# Altium project IOT_Help_2.PrjPcb
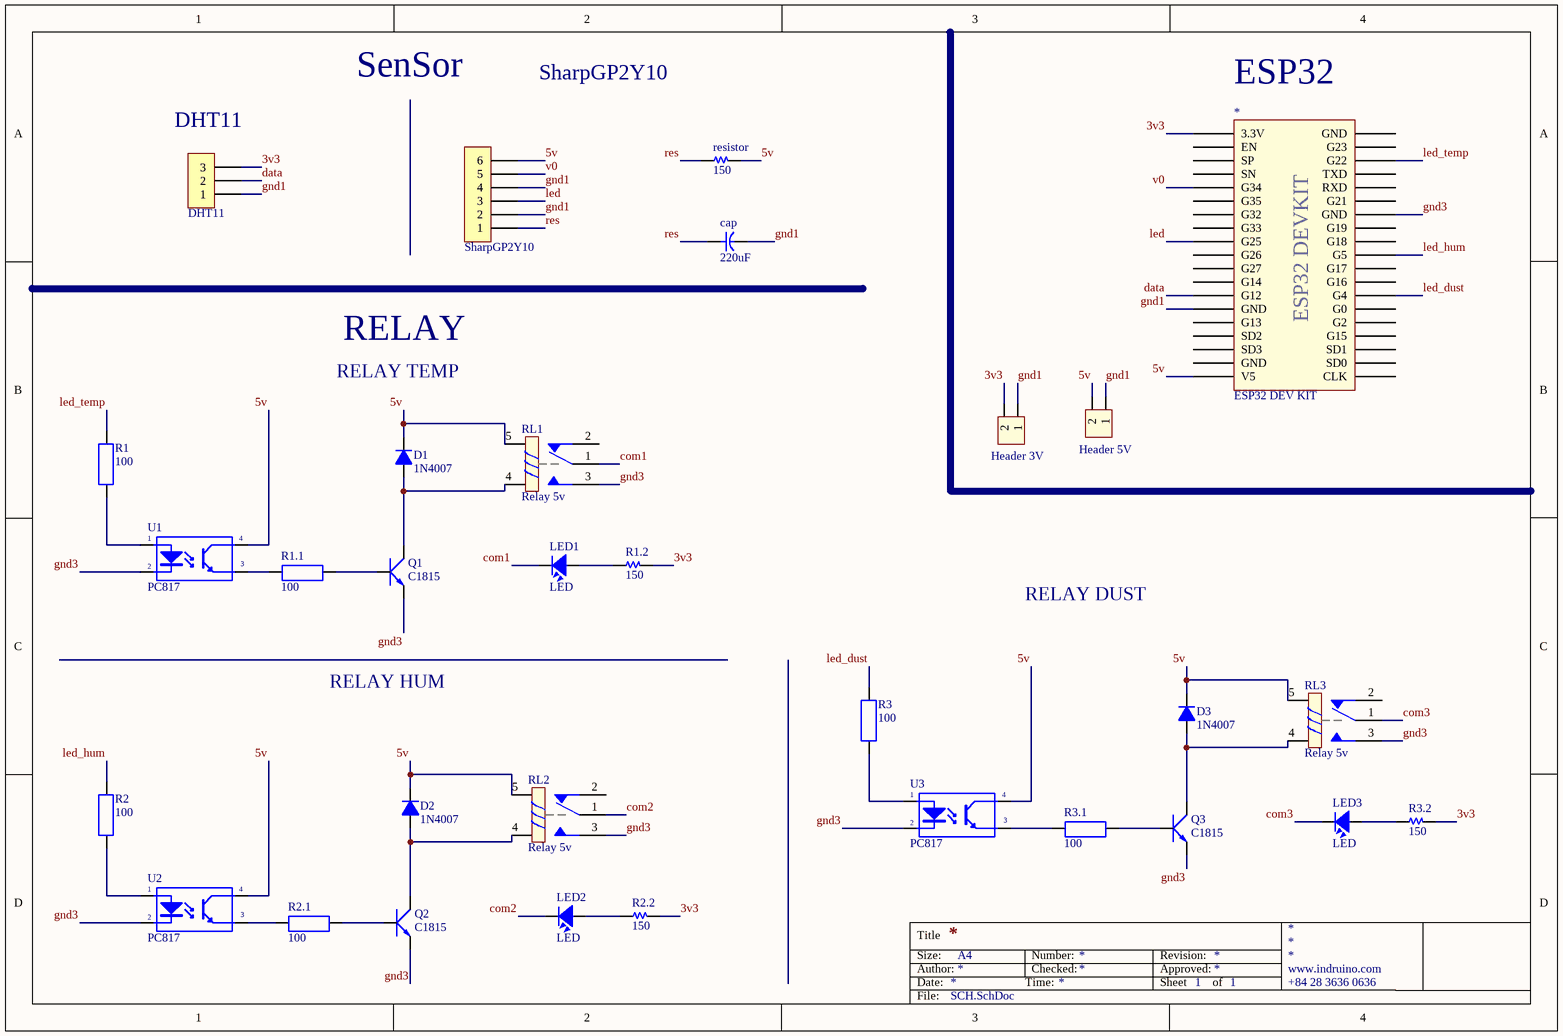
[diagram p0: SCH.SchDoc]
1 sheet, 31 parts. Net scope: global (net labels, ports and power ports of the same name join across sheets).
Board file: PCB1.PcbDoc

## Sheet SCH.SchDoc
size A4; SheetNumber: 1; SheetTotal: 1

### Parts
*  ESP32 DEV KIT  [ESP32 DEVKIT]
cap  220uF  [CYL/D.250/LS.100]
D1  1N4007  [D0.5A]
D2  1N4007  [D0.5A]
D3  1N4007  [D0.5A]
DHT11  DHT11  [XH2.54M-3]
Header_3V  Header 3V  [XH2.54M-2]
Header_5V  Header 5V  [XH2.54M-2]
LED1  LED  [led5mm_yellow]
LED2  LED  [led5mm_yellow]
LED3  LED  [led5mm_yellow]
Q1  C1815  [QTO-92]
Q2  C1815  [QTO-92]
Q3  C1815  [QTO-92]
R1  100  [Res_15mm]
R1.1  100  [Res_15mm]
R1.2  150  [R 1/4W/300]
R2  100  [Res_15mm]
R2.1  100  [Res_15mm]
R2.2  150  [R 1/4W/300]
R3  100  [Res_15mm]
R3.1  100  [Res_15mm]
R3.2  150  [R 1/4W/300]
resistor  150  [R 1/4W/300]
RL1  Relay 5v  [RL_SPDT_10A]
RL2  Relay 5v  [RL_SPDT_10A]
RL3  Relay 5v  [RL_SPDT_10A]
SharpGP2Y10  SharpGP2Y10  [XH2.54M-6]
U1  PC817  [DIP4/W0.3]
U2  PC817  [DIP4/W0.3]
U3  PC817  [DIP4/W0.3]

### Nets
3v3: *.1(3.3V) DHT11.3 Header_3V.2 R1.2.2 R2.2.2 R3.2.2
5v: *.19(V5) D1.2(K) D2.2(K) D3.2(K) Header_5V.2 resistor.2 RL1.5 RL2.5 RL3.5 SharpGP2Y10.6 U1.4(C) U2.4(C) U3.4(C)
com1: LED1.2 RL1.1
com2: LED2.2 RL2.1
com3: LED3.2 RL3.1
data: *.13(G12) DHT11.2
gnd1: *.14(GND) cap.2 DHT11.1 Header_3V.1 Header_5V.1 SharpGP2Y10.2 SharpGP2Y10.4
gnd3: *.32(GND) Q1.1(E) Q2.1(E) Q3.1(E) RL1.3 RL2.3 RL3.3 U1.2(K) U2.2(K) U3.2(K)
led: *.9(G25) SharpGP2Y10.3
led_dust: *.26(G4) R3.2
led_hum: *.29(G5) R2.2
led_temp: *.36(G22) R1.2
res: cap.1 resistor.1 SharpGP2Y10.1
v0: *.5(G34) SharpGP2Y10.5
NetD1_1: D1.1(A) Q1.2(C) RL1.4
NetD2_1: D2.1(A) Q2.2(C) RL2.4
NetD3_1: D3.1(A) Q3.2(C) RL3.4
NetLED1_1: LED1.1 R1.2.1
NetLED2_1: LED2.1 R2.2.1
NetLED3_1: LED3.1 R3.2.1
NetQ1_3: Q1.3(B) R1.1.1
NetQ2_3: Q2.3(B) R2.1.1
NetQ3_3: Q3.3(B) R3.1.1
NetR1.1_2: R1.1.2 U1.3(E)
NetR1_1: R1.1 U1.1(A)
NetR2.1_2: R2.1.2 U2.3(E)
NetR2_1: R2.1 U2.1(A)
NetR3.1_2: R3.1.2 U3.3(E)
NetR3_1: R3.1 U3.1(A)

Not connected (* = marked no-connect by the designer): * 2(EN) 3(SP) 4(SN) 6(G35) 7(G32) 8(G33) 10(G26) 11(G27) 12(G14) 15(G13) 16(SD2) 17(SD3) 18(GND) 20(CLK) 21(SD0) 22(SD1) 23(G15) 24(G2) 25(G0) 27(G16) 28(G17) 30(G18) 31(G19) 33(G21) 34(RXD) 35(TXD) 37(G23) 38(GND); RL1 2; RL2 2; RL3 2

### Notes on the sheet
- SenSor
- SharpGP2Y10
- (near *) ESP32
- (near DHT11) DHT11
- RELAY TEMP
- RELAY
- RELAY DUST
- RELAY HUM
- Title
- Size:
- Date:
- Author:
- A4
- Time:
- Number:
- Checked:
- Revision:
- Sheet
- Approved:
- of
- www.indruino.com <http://www.indruino.com>
- +84 28 3636 0636
- File:
- (in symbol ESP32 DEV KIT) ESP32 DEVKIT

### Library data of the parts
cap = Capacitor: Capacitor pol
D1-D3 = D1A: Diode 1A; Value: 1N4007
DHT11 = Header 3P 2.54 Duc Thang: Cắm; Ten_Linh_Kien: Header 3P XH2.54-3P Đực Thẳng; Don_Vi: Con; Ma_Hang: MH001292; Chung_Loai: Cắm
Header_3V Header_5V = Header 2P 2.54 Duc Thang: Cắm; Ten_Linh_Kien: Header 2P XH2.54-2P Đực Thẳng; Don_Vi: Con; Ma_Hang: MH001283; Chung_Loai: Cắm
LED1-LED3 = LED: LED Single colour Green and Red; Value: LED 3 ly Single Colour
Q1-Q3 = C1815: NPN 600mW, ECB; Value: C1815
R1 R1.1 R2 R2.1 R3 R3.1 = R1W: Resistor 1W; Value: R1W - 100
R1.2 R2.2 R3.2 resistor = Resistor
RL1-RL3 = Relay 1: Relay SPDT,10A - 12VDC 5 Pin; Value: Relay SPDT, 10A, 12V
SharpGP2Y10 = Header 6P 2.54 Duc Thang: Cắm; Ten_Linh_Kien: Header 6P XH2.54-6P Đực Thẳng; Don_Vi: Con; Ma_Hang: MH001972; Chung_Loai: Cắm
U1-U3 = PC817: Single Opto; Value: PC817